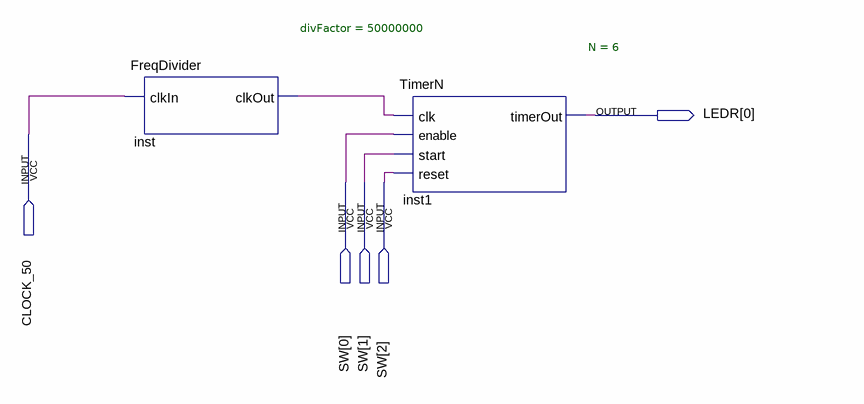
[diagram p0: schematic sheet]
// Quartus schematic Timer_T.bdf as structural Verilog: 2 symbols, 5 pins
module Timer_T (
  input  CLOCK_50,
  input  [2:0] SW,
  output [0:0] LEDR
);

  wire inst_clkout;

  FreqDivider #(.divFactor(50000000)) inst (.clkIn(CLOCK_50), .clkOut(inst_clkout));
  TimerN #(.N(6)) inst1 (.clk(inst_clkout), .enable(SW[0]), .start(SW[1]), .reset(SW[2]), .timerOut(LEDR[0]));
endmodule
